# EAGLE schematic riffle-turbidity (EAGLE 7.6.0)
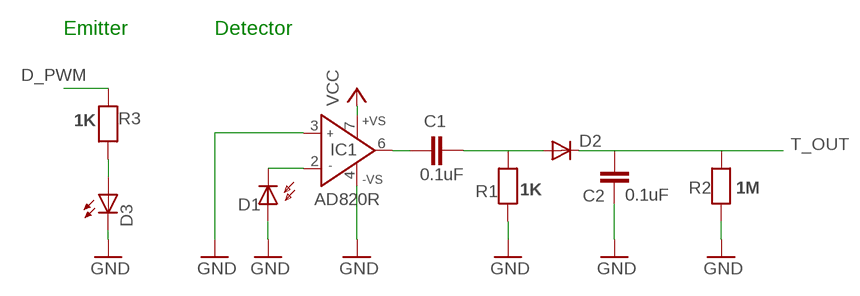
[diagram p0: schematic, sheet 1]

## Parts
C1  0.1uF  CAP0603-CAP  [0603-CAP]
C2  0.1uF  CAP0603-CAP  [0603-CAP]
D1  BPX65  [BPX65]
D2  1N4148DO35-7  [DO35-7]
D3  LZ1-00WW03  [LZ1-00WW03]
IC1  AD820R  [SO8]
R1  1K  RESISTOR_0603_NOOUT  [0603-NO]
R2  1M  RESISTOR_0603_NOOUT  [0603-NO]
R3  1K  RESISTOR_0603_NOOUT  [0603-NO]

## Nets
D_PWM: R3.1
GND: C2.1 D1.A D3.1(C) D3.4(C) IC1.3(IN+) IC1.4(-VS) R1.1 R2.1
N$1: D1.K(C) IC1.2(IN-)
N$2: C1.2 IC1.6(OUT)
N$3: C1.1 D2.A R1.2
N$4: D3.2(A) D3.3(A) D3.5(A) R3.2
T_OUT: C2.2 D2.C R2.2
VCC: IC1.7(+VS)

## Notes on the sheet
- Emitter | Detector

## Library data of the parts
C1 C2 = SparkFun:CAP: Capacitor Standard 0603 ceramic capacitor, and 0.1" leaded capacitor.
D1 = opto-trans-siemens:BPX65: PHOTO DIODE; MPN: BPX65.; OC_FARNELL: 327451; OC_NEWARK: 06WX2764
D2 = diode:1N4148: DIODE high speed (Philips)
D3 = led:LZ1-00WW03: High Luminous Efficacy 3W Warm White LED Emitter Source: http://www.ledengin.com/products/3wLZ/LZ1-00WW03.pdf
IC1 = analog-devices:AD820: Single-Supply, Rail-to-Rail, Low Power, FET Input Op Amp Source: http://www.analog.com/static/imported-files/data_sheets/AD820.pdf; OC_FARNELL: 1838867; OC_NEWARK: unknown
R1-R3 = microbuilder:RESISTOR: Resistors For new designs, use the packages preceded by an '_' character since they are more reliable: The following footprints should be used on most boards: _0402 - Standard footprint for regular board layouts _0603 - Standard footprint for regular board layouts _0805 - Standard footprint for regular board layouts _1206 - Standard footprint for regular board layouts For extremely tight-pitch boards where space is at a premium, the following 'micro-pitch' footprints can be used (smaller pads, no silkscreen outline, etc.): _0402MP - Micro-pitch footprint for very dense/compact boards _0603MP - Micro-pitch footprint for very dense/compact boards _0805MP - Micro-pitch footprint for very dense/compact boards _1206MP - Micro-pitch footprint for very dense/compact boards

## Net classes
1 power: width 0.305 mm